# Altium schematic sheet BG96.SchDoc: FIoT Rev 2.0
size A4; ApprovedBy: PM; CheckedBy: PM; Author: AG; CompanyName: -; DrawnBy: AG; Engineer: AG; DocumentNumber: 18072022 - 1; Revision: 0; SheetNumber: 3; SheetTotal: 8; ENG_APP_DATE: --/--/--; DSN_APP_DATE: --/--/--; CHK_APP_DATE: --/--/--
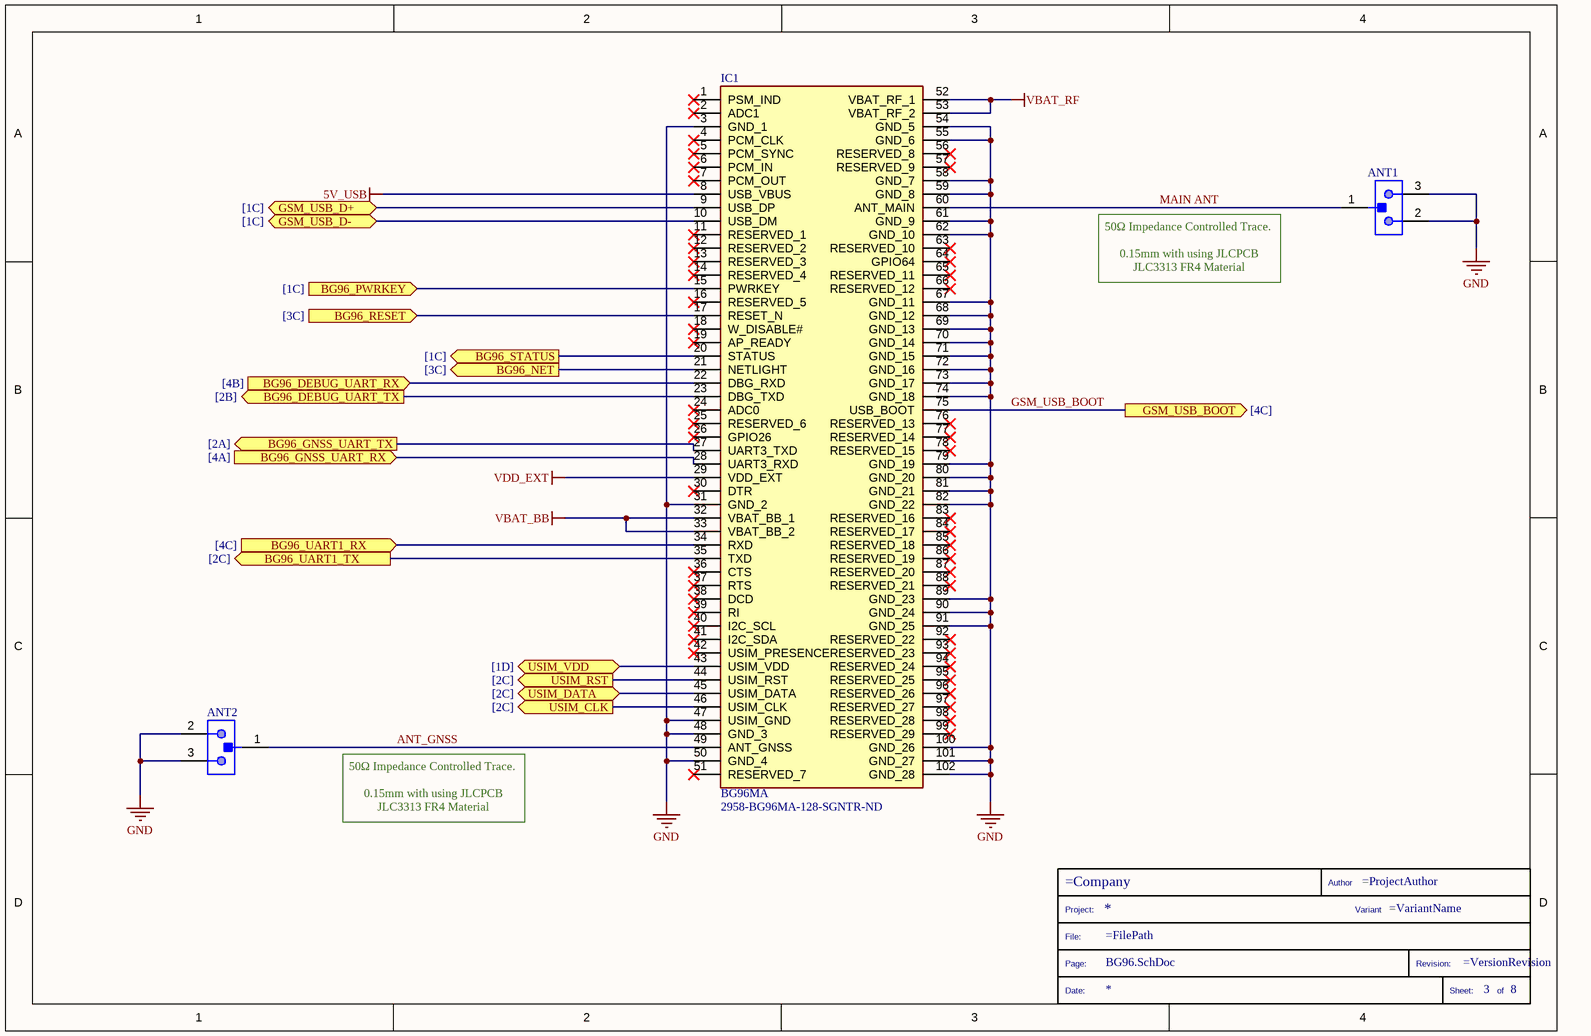
[diagram p0: BG96.SchDoc]

## Parts
*?  TitleBlock  (value not drawn)  (graphical)
ANT1  U.FL-R-SMT(01)  [HRS-U.FL-R-SMT(10)_V]  (value not drawn)
ANT2  U.FL-R-SMT(01)  [HRS-U.FL-R-SMT(10)_V]  (value not drawn)
IC1  BG96MA  Supplier Part Number 1: 2958-BG96MA-128-SGNTR-ND  [BG96MA]

## Ports
BG96_DEBUG_UART_RX (in, see [4B]), BG96_DEBUG_UART_TX (out, see [2B]), BG96_GNSS_UART_RX (in, see [4A]), BG96_GNSS_UART_TX (out, see [2A]), BG96_NET (out, see [3C]), BG96_PWRKEY (in, see [1C]), BG96_RESET (in, see [3C]), BG96_STATUS (out, see [1C]), BG96_UART1_RX (in, see [4C]), BG96_UART1_TX (out, see [2C]), GSM_USB_BOOT (out, see [4C]), GSM_USB_D+ (bidir, see [1C]), GSM_USB_D- (bidir, see [1C]), USIM_CLK (out, see [2C]), USIM_DATA (bidir, see [2C]), USIM_RST (out, see [2C]), USIM_VDD (bidir, see [1D])

## Nets
5V_USB: IC1.8(USB_VBUS)
GND: ANT1.2 ANT1.3 ANT2.2 ANT2.3 IC1.3(GND_1) IC1.31(GND_2) IC1.47(USIM_GND) IC1.48(GND_3) IC1.50(GND_4) IC1.54(GND_5) IC1.55(GND_6) IC1.58(GND_7) IC1.59(GND_8) IC1.61(GND_9) IC1.62(GND_10) IC1.67(GND_11) IC1.68(GND_12) IC1.69(GND_13) IC1.70(GND_14) IC1.71(GND_15) IC1.72(GND_16) IC1.73(GND_17) IC1.74(GND_18) IC1.79(GND_19) IC1.80(GND_20) IC1.81(GND_21) IC1.82(GND_22) IC1.89(GND_23) IC1.90(GND_24) IC1.91(GND_25) IC1.100(GND_26) IC1.101(GND_27) IC1.102(GND_28)
VBAT_BB: IC1.32(VBAT_BB_1) IC1.33(VBAT_BB_2)
VBAT_RF: IC1.52(VBAT_RF_1) IC1.53(VBAT_RF_2)
VDD_EXT: IC1.29(VDD_EXT)
ANT_GNSS: ANT2.1 IC1.49(ANT_GNSS)
BG96_DEBUG_UART_RX: IC1.22(DBG_RXD) ; port BG96_DEBUG_UART_RX
BG96_DEBUG_UART_TX: IC1.23(DBG_TXD) ; port BG96_DEBUG_UART_TX
BG96_GNSS_UART_RX: IC1.28(UART3_RXD) ; port BG96_GNSS_UART_RX
BG96_GNSS_UART_TX: IC1.27(UART3_TXD) ; port BG96_GNSS_UART_TX
BG96_NET: IC1.21(NETLIGHT) ; port BG96_NET
BG96_PWRKEY: IC1.15(PWRKEY) ; port BG96_PWRKEY
BG96_RESET: IC1.17(RESET_N) ; port BG96_RESET
BG96_STATUS: IC1.20(STATUS) ; port BG96_STATUS
BG96_UART1_RX: IC1.34(RXD) ; port BG96_UART1_RX
BG96_UART1_TX: IC1.35(TXD) ; port BG96_UART1_TX
GSM_USB_BOOT: IC1.75(USB_BOOT) ; port GSM_USB_BOOT
GSM_USB_D+: IC1.9(USB_DP) ; port GSM_USB_D+
GSM_USB_D-: IC1.10(USB_DM) ; port GSM_USB_D-
MAIN ANT: ANT1.1 IC1.60(ANT_MAIN)
USIM_CLK: IC1.46(USIM_CLK) ; port USIM_CLK
USIM_DATA: IC1.45(USIM_DATA) ; port USIM_DATA
USIM_RST: IC1.44(USIM_RST) ; port USIM_RST
USIM_VDD: IC1.43(USIM_VDD) ; port USIM_VDD

Not connected (* = marked no-connect by the designer): IC1 1(PSM_IND)* 2(ADC1)* 4(PCM_CLK)* 5(PCM_SYNC)* 6(PCM_IN)* 7(PCM_OUT)* 11(RESERVED_1)* 12(RESERVED_2)* 13(RESERVED_3)* 14(RESERVED_4)* 16(RESERVED_5)* 18(W_DISABLE#)* 19(AP_READY)* 24(ADC0)* 25(RESERVED_6)* 26(GPIO26)* 30(DTR)* 36(CTS)* 37(RTS)* 38(DCD)* 39(RI)* 40(I2C_SCL)* 41(I2C_SDA)* 42(USIM_PRESENCE)* 51(RESERVED_7)* 56(RESERVED_8)* 57(RESERVED_9)* 63(RESERVED_10)* 64(GPIO64)* 65(RESERVED_11)* 66(RESERVED_12)* 76(RESERVED_13)* 77(RESERVED_14)* 78(RESERVED_15)* 83(RESERVED_16)* 84(RESERVED_17)* 85(RESERVED_18)* 86(RESERVED_19)* 87(RESERVED_20)* 88(RESERVED_21)* 92(RESERVED_22)* 93(RESERVED_23)* 94(RESERVED_24)* 95(RESERVED_25)* 96(RESERVED_26)* 97(RESERVED_27)* 98(RESERVED_28)* 99(RESERVED_29)*

## Notes on the sheet
- 50Ω Impedance Controlled Trace.
  0.15mm with using JLCPCB JLC3313 FR4 Material
- DWG. NO.
- REV.
- SHT.
- THIS DOCUMENT AND THE DATA DISCLOSED HEREIN OR HEREWITH IS THE PROPERTY OF ALTIUM LIMITED AND MAY BE FREELY DISTRIBUTED IN WHOLE. NO RIGHTS ARE RESERVED OR EXPRESS OR IMPLIED WARANTEE GIVEN.
- REVISION
- DESCRIPTION
- DATE
- APPROVED
- ENG:
- APPROVALS
- PROJECT
- DSN:
- CHK:
- REFERENCE DOCUMENTS
- PROJECT REVISION:
- TITLE
- DOCUMENT REVISION:
- DESIGN ITEM:
- BOM:
- FAB DWG:
- PCB DWG:
- ASSY DWG:
- SCALE:
- SIZE
- B
- CAGE CODE
- FILE NAME
- DWG NO.
- SHEET
- OF
- REV
- (in symbol TitleBlock) Author; Project:; Variant; File:; Page:; Revision:; Date:; Sheet:; of

## Library data of the parts
ANT1 ANT2 = LPN00021: CONN RECPT ULTRA-MINI COAX SMD; Manufacturer 1: Hirose Electric; Manufacturer Part Number 1: U.FL-R-SMT(01); Supplier 1: Farnell; Supplier Part Number 1: 3908021; Lumen Part Number: LPN00021
IC1 = LPN0006: Cellular EDGE, GPRS, GSM, HSPA, LTE, UMTS Transceiver Module 850MHz, 900MHz, 1.8GHz, 1.9GHz Antenna Not Included Surface Mount; Supplier 1: Digi-Key; Lumen Part Number: LPN0006